# EAGLE design touch_rev1 (EAGLE 6.5.0)
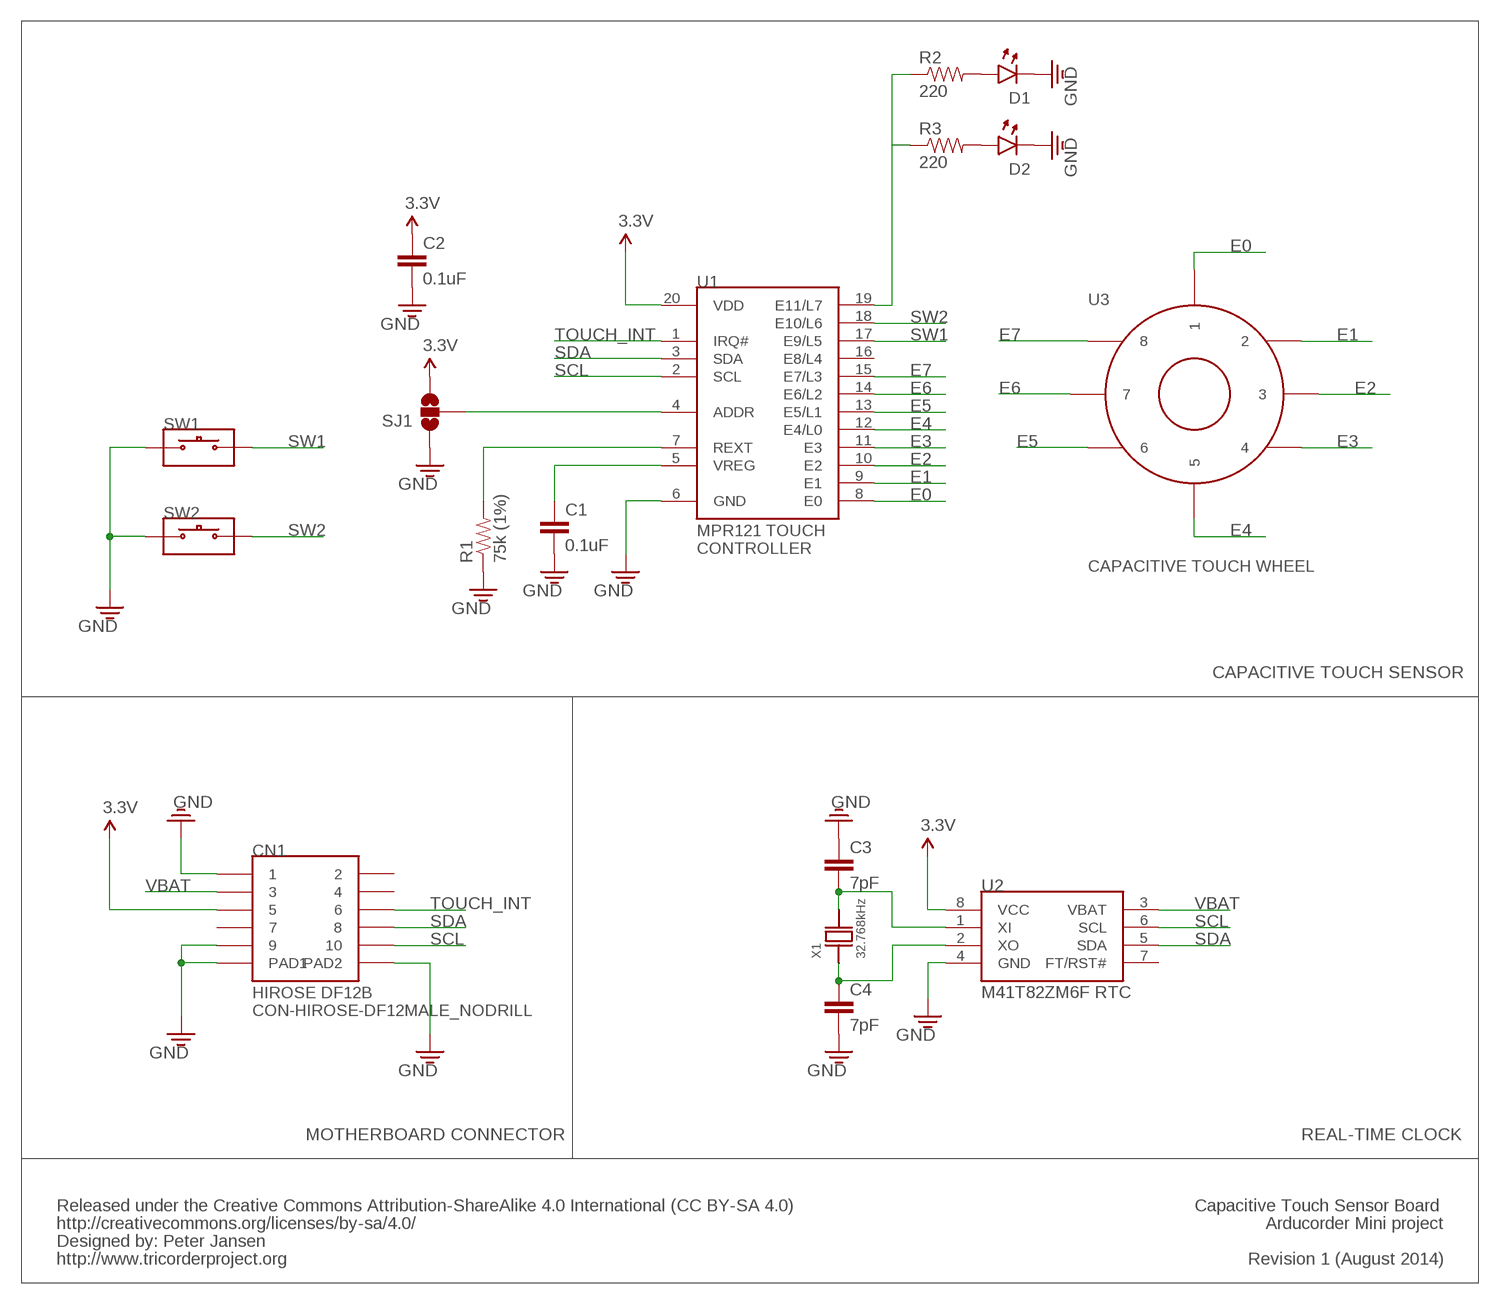
[diagram p0: schematic, sheet 1]

## Parts
C1  0.1uF  CAP0603  [0603]
C2  0.1uF  CAP0603  [0603]
C3  7pF  CAP0603  [0603]
C4  7pF  CAP0603  [0603]
CN1  CON-HIROSE-DF12MALE_NODRILL  [DF12(3.0)-10DS-0.5V(86)]
D1  0605-LED  [0603-LED]
D2  0605-LED  [0603-LED]
R1  75k (1%)  RESISTOR0603  [0603]
R2  220  RESISTOR0603  [0603]
R3  220  RESISTOR0603  [0603]
SJ1  SOLDERJUMPER_2WAYPASTE1&2  [SJ_3_PASTE1&2]
SW1  SWITCH  [KMT071]
SW2  SWITCH  [KMT071]
U1  MPR121-TOUCH-CONTROLLER  [QFN-3X3-20]
U2  M41T82ZM6F  [8-SOIC]
U3  CAPACITIVE-WHEEL-8  [CAPACITIVE-WHEEL-8]
X1  32.768kHz  CRYSTAL  [CRYSTAL-9HT10]

## Nets
3.3V: C2.1 CN1.5 SJ1.3 U1.20(VDD) U2.8(VCC)
E0: U1.8(E0) U3.1
E1: U1.9(E1) U3.2
E2: U1.10(E2) U3.3
E3: U1.11(E3) U3.4
E4: U1.12(E4/L0) U3.5
E5: U1.13(E5/L1) U3.6
E6: U1.14(E6/L2) U3.7
E7: U1.15(E7/L3) U3.8
GND: C1.2 C2.2 C3.1 C4.2 CN1.1 CN1.9 CN1.PAD1 CN1.PAD2 D1.CATHODE D2.CATHODE R1.1 SJ1.1 SW1.1A SW2.1A U1.6(GND) U2.4(GND)
N$1: D1.ANODE R2.2
N$2: D2.ANODE R3.2
N$3: C1.1 U1.5(VREG)
N$4: R1.2 U1.7(REXT)
N$5: SJ1.2 U1.4(ADDR)
N$6: R2.1 R3.1 U1.19(E11/L7)
N$7: C4.1 U2.2(XO) X1.1
N$8: C3.2 U2.1(XI) X1.2
SCL: CN1.10 U1.2(SCL) U2.6(SCL)
SDA: CN1.8 U1.3(SDA) U2.5(SDA)
SW1: SW1.2A U1.17(E9/L5)
SW2: SW2.2A U1.18(E10/L6)
TOUCH_INT: CN1.6 U1.1(IRQ#)
VBAT: CN1.3 U2.3(VBAT)
Unconnected: CN1.2 CN1.4 CN1.7 U1.16(E8/L4) U2.7(FT/RST#)

## Notes on the sheet
- CAPACITIVE TOUCH SENSOR
- MOTHERBOARD CONNECTOR | REAL-TIME CLOCK
- Released under the Creative Commons Attribution-ShareAlike 4.0 International (CC BY-SA 4.0) | Capacitive Touch Sensor Board
- http://creativecommons.org/licenses/by-sa/4.0/ | Arducorder Mini project
- Designed by: Peter Jansen
- http://www.tricorderproject.org | Revision 1 (August 2014)

## Library data of the parts
C1-C4 = notes_mark5a:CAP: Capacitor Standard 0603 ceramic capacitor, and 0.1" leaded capacitor.
CN1 = notes-arducorder-mini:CON-HIROSE-DF12
D1 D2 = notes_mark5a1:0605-LED
R1-R3 = notes_mark5a1:RESISTOR: Resistor Basic schematic elements and footprints for 0603, 1206, and PTH 1/10th watt (small) resistors.
SJ1 = SparkFun-Passives:SOLDERJUMPER_2WAY: Solder Jumper 2 way solder jumper
SW1 SW2 = notes-arducorder-mini:SWITCH
U1 = notes-arducorder-mini:MPR121-TOUCH-CONTROLLER: MPR121 Capacitive Touch Controller
U2 = notes_mark5a:M41T82ZM6F: ST Electronics M41T82 Real-time clock (RTC) with Serial I2C interface and battery switchover
U3 = notes-arducorder-mini:CAPACITIVE-WHEEL-8
X1 = notes_mark5a:CRYSTAL

## Board
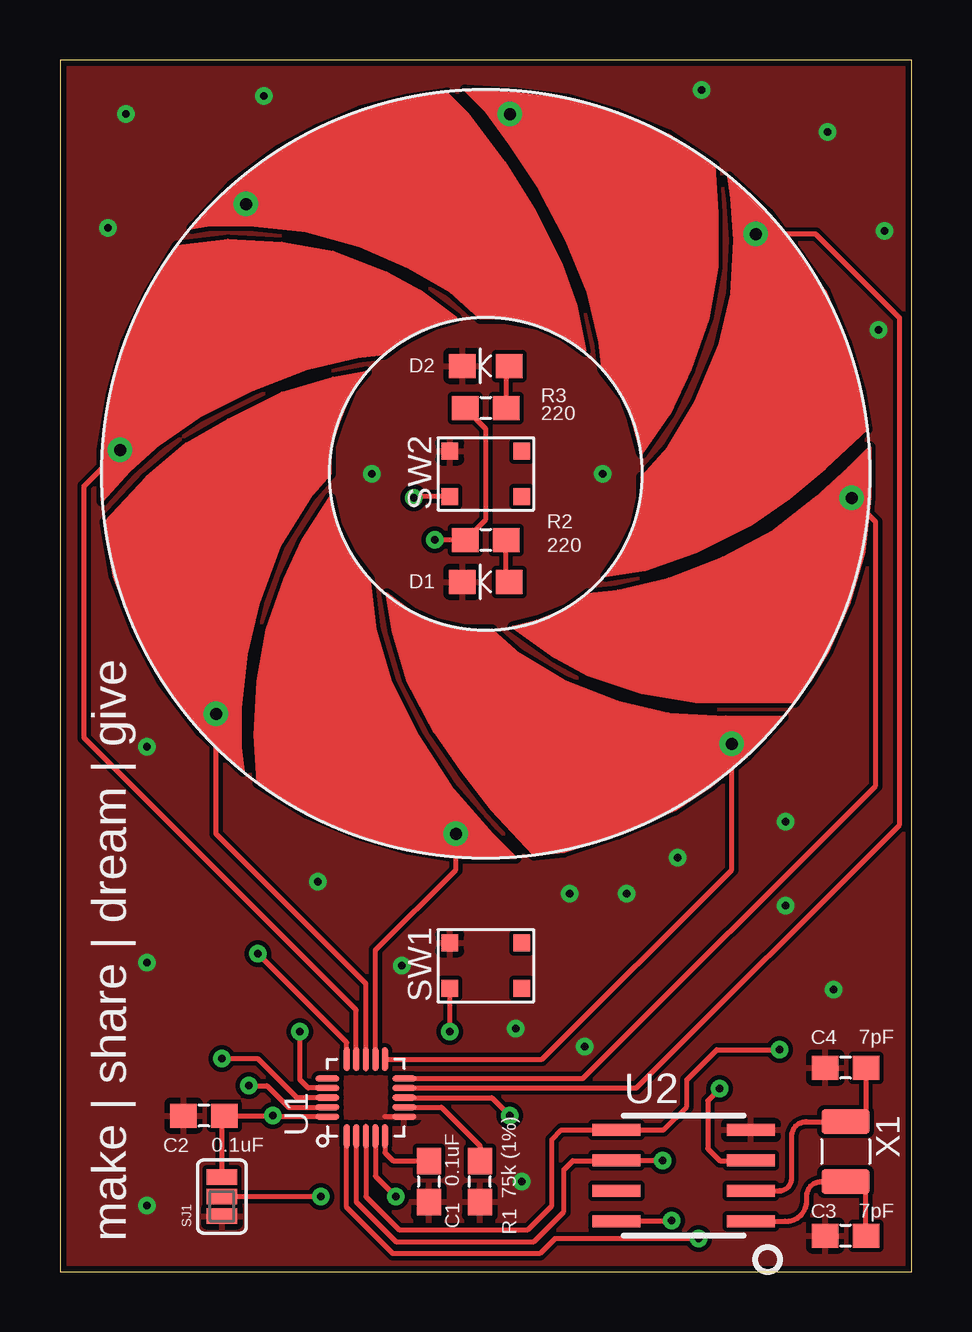
[diagram p1: board, top side]
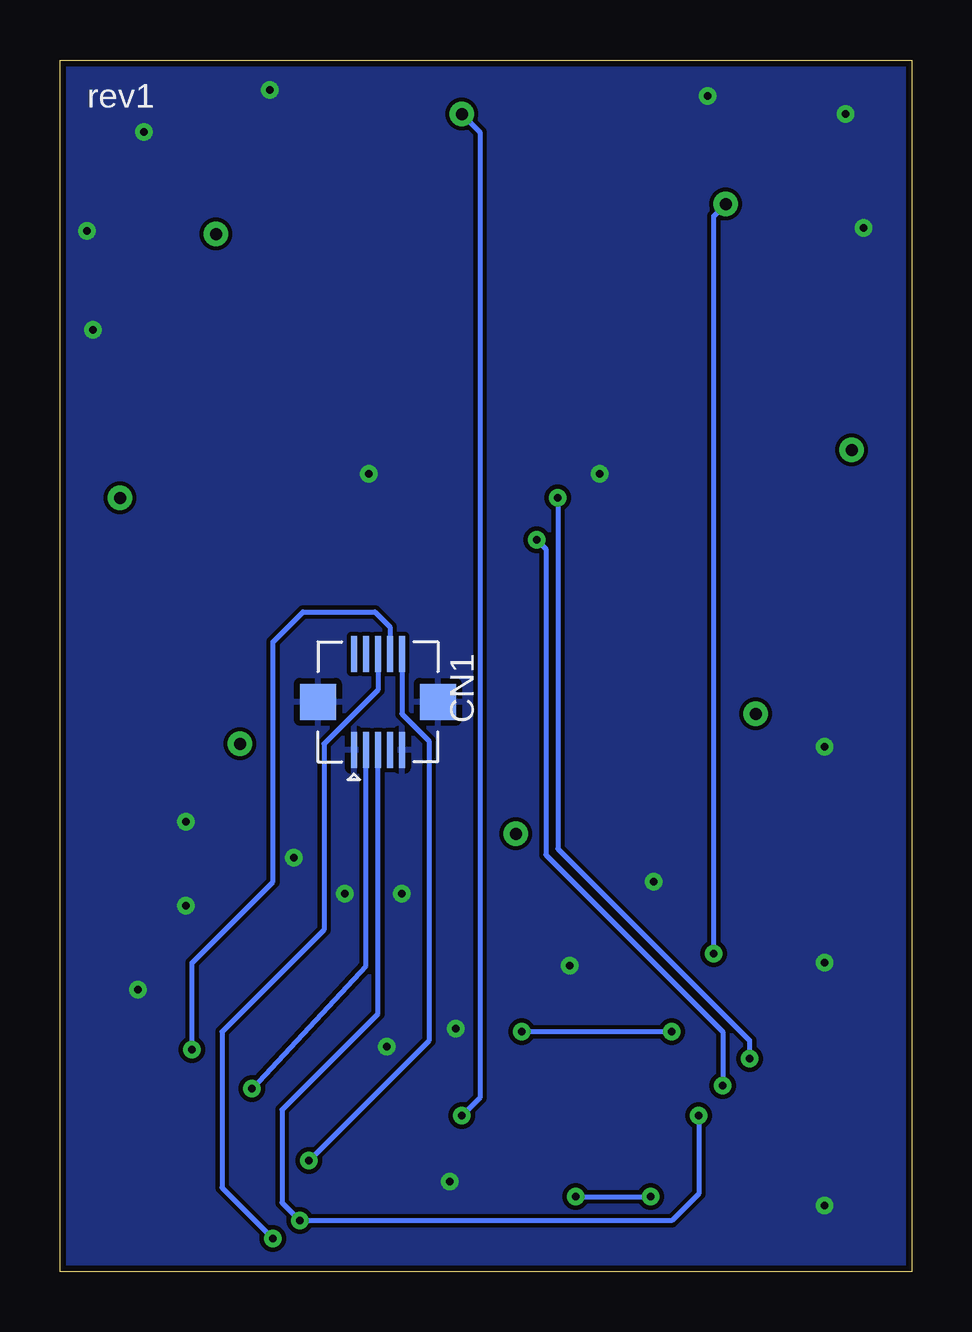
[diagram p2: board, bottom side, seen from below]

Size 35.5 x 50.5 mm. Coordinates in mm from the lower left corner, seen from the top.
Outline: 0,0 35.5,0 35.5,50.5 0,50.5 0,0
Copper layers (1*16): Top 0.035mm / dielectric 1.5mm / Bottom 0.035mm
Design rules "default *": minimum track width 7mil, minimum drill 13mil, track to track 7mil, track to pad 7mil, pad to pad 7mil, via to via 7mil, smd to smd 7mil, copper to edge 10mil, drill to drill 8mil, minimum pad ring 10mil, minimum via ring 8mil, stop-mask expansion 4mil, vias tented up to drill 0mil, thermal gap 10mil
tKeepout: area 1.2,25.8 to 16.8,38.8
bKeepout: area 0.8,21.2 to 8.8,27.2

### Footprints (pad centres in the part's own frame; a part is rotated, then mirrored left to right if it is on the bottom)
0603 = smd 1.1 x 1: 1 -0.85,0; 2 0.85,0
DF12(3.0)-10DS-0.5V(86) = smd 0.25 x 1.5 bottom: 1 -1,2; 2 -1,-2; 3 -0.5,2; 4 -0.5,-2; 5 0,2; 6 0,-2; 7 0.5,2; 8 0.5,-2; 9 1,2; 10 1,-2 | smd 1.5 x 1.5 bottom: PAD1 -2.5,0; PAD2 2.5,0
0603-LED = smd 1.1 x 1: ANODE -0.975,0; CATHODE 0.975,0
SJ_3_PASTE1&2 = smd 0.635 x 1.27: 1 -0.813,0; 2 0,0; 3 0.813,0
KMT071 = smd 0.7 x 0.7: 1A -1.5,0.95; 1B 1.5,0.95; 2A -1.5,-0.95; 2B 1.5,-0.95
QFN-3X3-20 = smd 1 x 0.25: 1 -1.6,0.8; 2 -1.6,0.4; 3 -1.6,0; 4 -1.6,-0.4; 5 -1.6,-0.8; 11 1.6,-0.8; 12 1.6,-0.4; 13 1.6,0; 14 1.6,0.4; 15 1.6,0.8 | smd 0.25 x 1: 6 -0.8,-1.6; 7 -0.4,-1.6; 8 0,-1.6; 9 0.4,-1.6; 10 0.8,-1.6; 16 0.8,1.6; 17 0.4,1.6; 18 0,1.6; 19 -0.4,1.6; 20 -0.8,1.6
8-SOIC = smd 2 x 0.5: 1 -2.81,1.905; 2 -2.81,0.635; 3 -2.81,-0.635; 4 -2.81,-1.905; 5 2.81,-1.905; 6 2.81,-0.635; 7 2.81,0.635; 8 2.81,1.905
CAPACITIVE-WHEEL-8 = drill 0.5: 1 1,15; 2 11.25,10; 3 15.25,-1; 4 10.25,-11.25; 5 -1.25,-15; 6 -11.25,-10; 7 -15.25,1; 8 -10,11.25
CRYSTAL-9HT10 = smd 1 x 2: 1 -1.25,0; 2 1.25,0

### Placement (x,y rotation side)
C1  15.38,3.75 270 top
C2  6,6.5 180 top
C3  32.75,1.5 0 top
C4  32.75,8.5 180 top
CN1  22.25,23.75 180 top
D1  17.75,28.75 180 top
D2  17.75,37.75 180 top
R1  17.5,3.75 90 top
R2  17.75,30.5 0 top
R3  17.75,36 0 top
SJ1  6.75,3.12 90 top
SW1  17.75,12.75 0 top
SW2  17.75,33.25 0 top
U1  12.75,7.25 90 top
U2  26,4 180 top
U3  17.75,33.25 0 top
X1  32.75,5 270 top

### Tracks (layer width: path | path; a pad name or v marks a point on that pad's centre or on a via)
3.3V  (via drill 0.33)
  Top 0.203: v25.5,2.12 25.47,2.09 U2.8 | SJ1.3 6.75,6.4 C2.1 6.9,6.45 6.95,6.5 v8.88,6.5 8.92,6.45 U1.20
  Bottom 0.203: v8.88,6.5 8.88,3.25 10,2.12 v25.5,2.12 26.25,2.88 26.25,6.75 22.25,10.75 CN1.5
E0  (via drill 0.33)
  Top 0.203: U1.8 18,7.25 v18.75,6.5
  Bottom 0.203: U3.1 18,47.5 18,7.25 v18.75,6.5
E1
  Top 0.203: U1.9 24.03,7.65 35,18.62 35,39.75 31.5,43.25 U3.2
E2
  Top 0.203: U1.10 21.8,8.05 34,20.25 34,31.25 U3.3
E3
  Top 0.203: U1.11 20.1,8.85 28,16.75 U3.4
E4
  Top 0.203: U1.12 13.15,13.4 16.5,16.75 U3.5
E5
  Top 0.203: U1.13 12.75,12 6.5,18.25 U3.6
E6
  Top 0.203: U1.14 12.35,10.9 1,22.25 1,32.75 U3.7
E7  (via drill 0.33)
  Top 0.203: U1.15 11.95,9.55 v8.25,13.25
  Bottom 0.203: v8.25,13.25 8.25,44 U3.8
GND  (via drill 0.33)
  Top 0.203: U1.6 13.55,6.45
  other vias: 21.88,9.38 19.25,3.75 14.25,12.75 3.62,12.88 32.25,11.75 30.25,15.25 30.25,18.75 3.62,2.75 10.75,16.25 3.62,21.88 23.62,15.75 21.25,15.75 25.75,17.25 34.12,39.25 2.75,48.25 26.75,49.25 34.38,43.38 32,47.5 8.5,49 2,43.5 13,33.25 22.62,33.25 19,10.12
  pour Bottom (rank 4): 35.25,0.25 0.25,0.25 0.25,50.25 35.25,50.25
  pour Top (rank 4): 35.25,0.25 0.25,0.25 0.25,50.25 35.25,50.25
N$1
  Top 0.203: D1.ANODE 18.6,28.88 R2.2
N$2
  Top 0.203: D2.ANODE 18.6,37.62 R3.2
N$3
  Top 0.203: U1.5 13.55,4.95 13.88,4.62 15.35,4.62 C1.1
N$4
  Top 0.203: U1.7 15.9,6.85 17.5,5.25 R1.2
N$5  (via drill 0.33)
  Top 0.203: U1.4 13.15,3.98 v14,3.12 | v10.88,3.12 SJ1.2
  Bottom 0.203: v14,3.12 v10.88,3.12
N$6  (via drill 0.33)
  Top 0.203: R3.1 16.9,35.98 17.75,35.12 17.75,31.35 R2.1 v15.62,30.5 | v7.88,7.75 8.62,7.75 9.52,6.85 U1.19
  Bottom 0.203: v15.62,30.5 15.25,30.12 15.25,17.38 7.88,10 v7.88,7.75
N$7
  Top 0.203: C4.1 33.6,6.25 X1.1 31.12,6.25 arc90 30.5,5.62 30.5,3.88 arc-90 29.99,3.37 U2.2
N$8
  Top 0.203: C3.2 33.6,3.75 X1.2 31.75,3.75 arc90 31.12,3.12 31.12,2.88 arc-90 30.22,2.09 U2.1
SCL  (via drill 0.33)
  Top 0.203: v25.12,4.62 U2.6 21.38,4.62 21,4.25 21,2.5 19.75,1.25 14,1.25 12.35,2.9 U1.2
  Bottom 0.203: v25.12,4.62 20.12,9.62 20.12,22.12 21.25,23.25 CN1.10
SDA  (via drill 0.33)
  Top 0.203: U1.3 12.75,3.12 14.12,1.75 19.5,1.75 20.5,2.75 20.5,5.5 20.91,5.91 U2.5 25.16,5.91 26.12,6.88 26.12,8 27.38,9.25 v30,9.25
  Bottom 0.203: v30,9.25 30,12.88 26.62,16.25 26.62,26.25 25.38,27.5 22.38,27.5 21.75,26.88 CN1.8
SW1  (via drill 0.33)
  Top 0.203: U1.17 10.35,7.65 10,8 v10,10 | v16.25,10 SW1.2A
  Bottom 0.203: v10,10 v16.25,10
SW2  (via drill 0.33)
  Top 0.203: SW2.2A 14.8,32.3 v14.75,32.25 | U1.18 9.88,7.25 8.25,8.88 v6.75,8.88
  Bottom 0.203: v14.75,32.25 14.75,17.62 6.75,9.62 v6.75,8.88
TOUCH_INT  (via drill 0.33)
  Top 0.203: v26.62,1.38 20.62,1.38 20,0.75 13.88,0.75 11.95,2.67 U1.1
  Bottom 0.203: v26.62,1.38 28.75,3.5 28.75,10 24.5,14.25 24.5,22 22.25,24.25 CN1.6
VBAT  (via drill 0.33)
  Top 0.203: v27.5,7.62 27,7.12 27,5.12 27.5,4.62 U2.3
  Bottom 0.203: v27.5,7.62 22.75,12.75 CN1.3

### Text on the board
tPlace: make | share | dream | give
bPlace: rev1